# EAGLE design afron_atmega328_chassis_B (EAGLE 6.1)
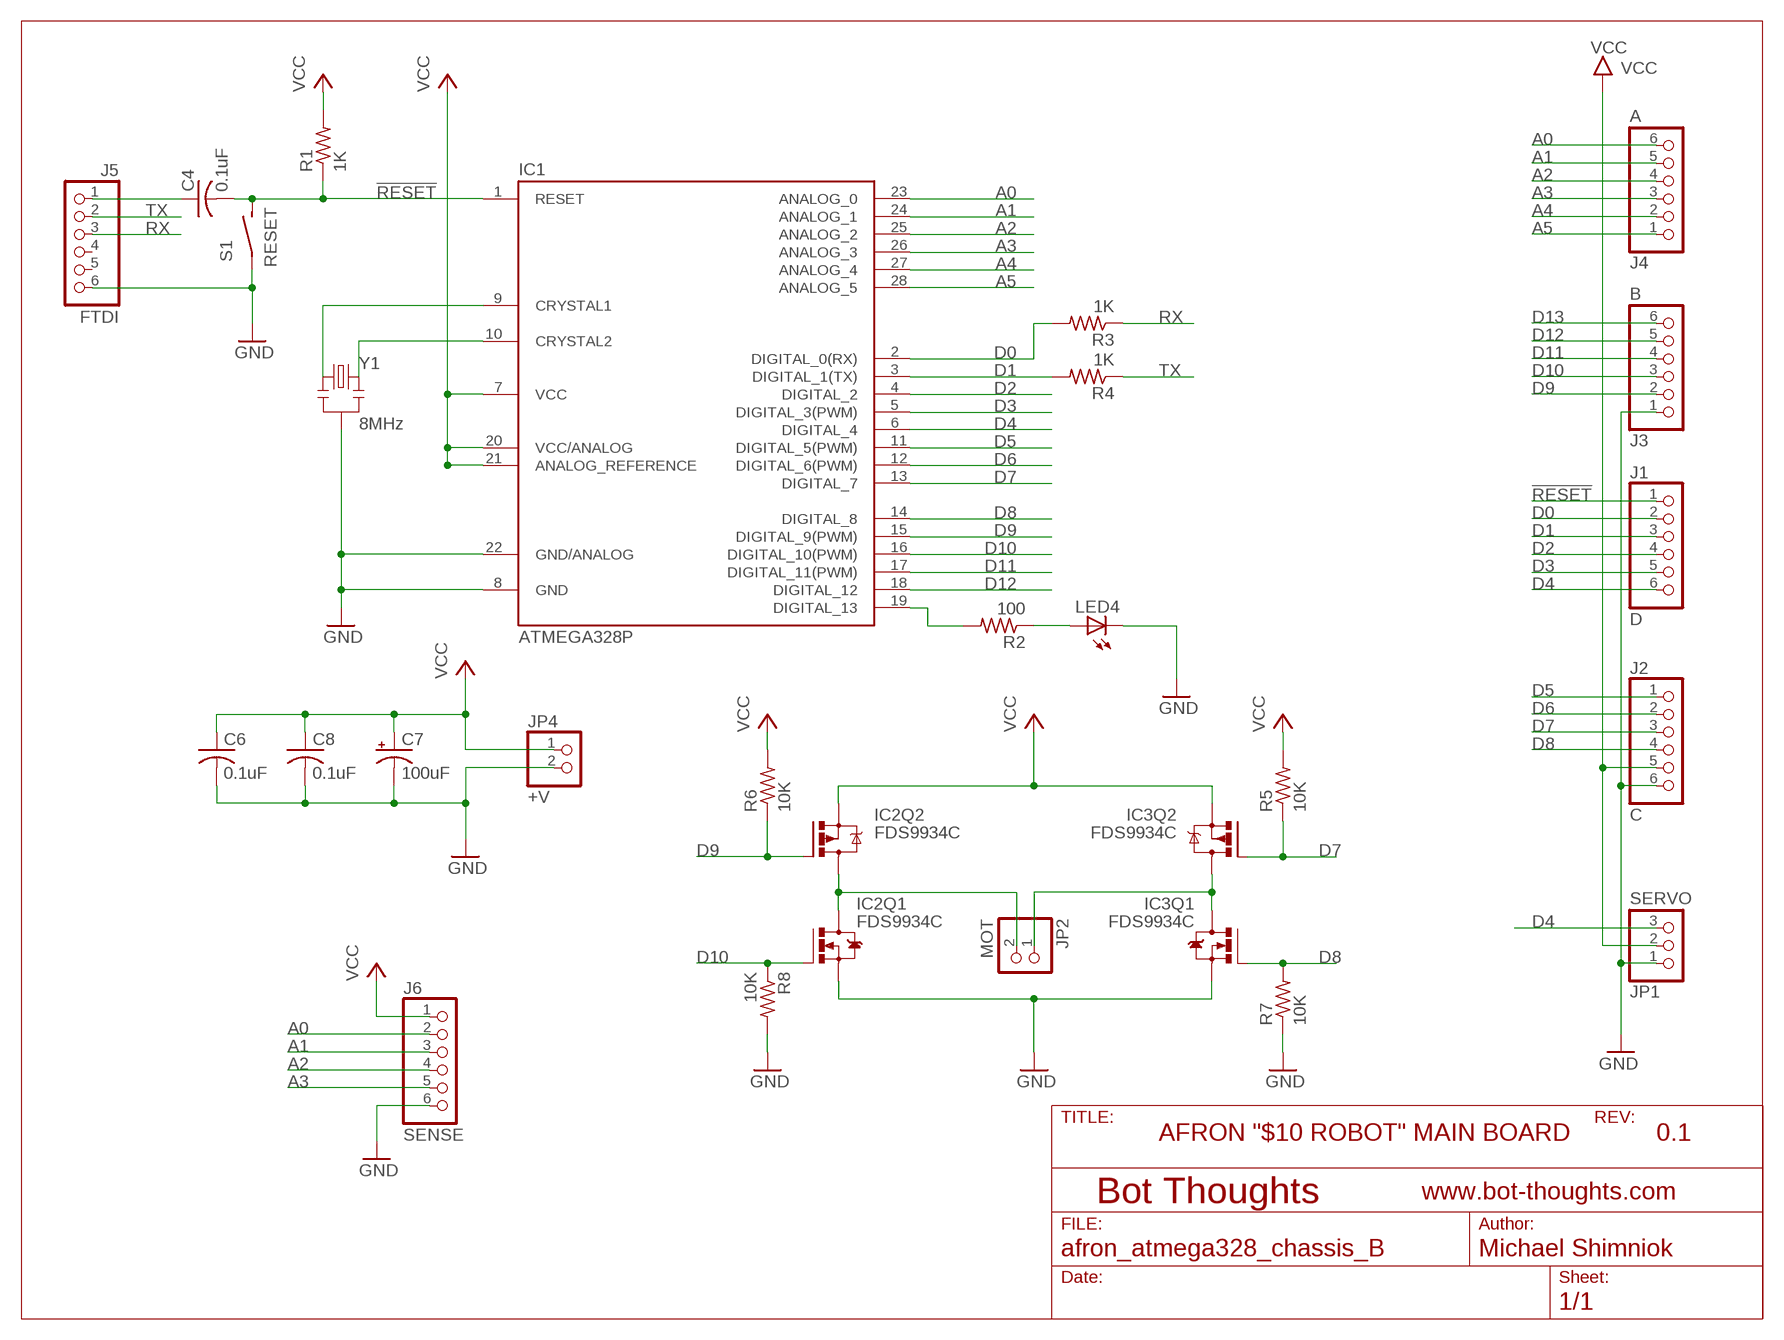
[diagram p0: schematic, sheet 1]

## Parts
C4  0.1uF  C-US050-024X044  [C050-024X044]
C6  0.1uF  C-US050-024X044  [C050-024X044]
C7  100uF  CPOL-USE2.5-6  [E2,5-6]
C8  0.1uF  C-US050-024X044  [C050-024X044]
IC1  ATMEGA328P  ATMEGA168-PU  [DIL28-3]
IC2  FDS9934C  [SOIC8]
IC3  FDS9934C  [SOIC8]
J1  D  PINHD-1X06_2.54  [1X06]
J2  C  PINHD-1X06_2.54  [1X06]
J3  B  PINHD-1X06_2.54  [1X06]
J4  A  PINHD-1X06_2.54  [1X06]
J5  FTDI  PINHD-1X06_2.54  [1X06]
J6  SENSE  PINHD-1X06_2.54  [1X06]
JP1  SERVO  PINHD-1X03_2.54  [1X03]
JP2  MOT  PINHD-1X02_2.54-S  [1X02-S]
JP4  +V  PINHD-1X02_2.54-S  [1X02-S]
LED4  LED3MM  [LED3MM]
R1  1K  R-US_0204/5  [0204/5]
R2  100  R-US_0204/5  [0204/5]
R3  1K  R-US_0204/5  [0204/5]
R4  1K  R-US_0204/5  [0204/5]
R5  10K  R-US_0204/5  [0204/5]
R6  10K  R-US_0204/5  [0204/5]
R7  10K  R-US_0204/5  [0204/5]
R8  10K  R-US_0204/5  [0204/5]
S1  RESET  SPST_TACT2  [6MMTACTILE]
Y1  8MHz  RESONATORPTH  [RESONATOR-PTH]

## Nets
!RESET: C4.2 IC1.1(RESET) J1.1 R1.1 S1.P$2(S)
A0: IC1.23(ANALOG_0) J4.6 J6.2
A1: IC1.24(ANALOG_1) J4.5 J6.3
A2: IC1.25(ANALOG_2) J4.4 J6.4
A3: IC1.26(ANALOG_3) J4.3 J6.5
A4: IC1.27(ANALOG_4) J4.2
A5: IC1.28(ANALOG_5) J4.1
D0: IC1.2(DIGITAL_0(RX)) J1.2 R3.2
D1: IC1.3(DIGITAL_1(TX)) J1.3 R4.2
D2: IC1.4(DIGITAL_2) J1.4
D3: IC1.5(DIGITAL_3(PWM)) J1.5
D4: IC1.6(DIGITAL_4) J1.6 JP1.3
D5: IC1.11(DIGITAL_5(PWM)) J2.1
D6: IC1.12(DIGITAL_6(PWM)) J2.2
D7: IC1.13(DIGITAL_7) IC3.4(Q2:G) J2.3 R5.1
D8: IC1.14(DIGITAL_8) IC3.2(Q1:G) J2.4 R7.2
D9: IC1.15(DIGITAL_9(PWM)) IC2.4(Q2:G) J3.2 R6.1
D10: IC1.16(DIGITAL_10(PWM)) IC2.2(Q1:G) J3.3 R8.1
D11: IC1.17(DIGITAL_11(PWM)) J3.4
D12: IC1.18(DIGITAL_12) J3.5
D13: IC1.19(DIGITAL_13) J3.6 R2.2
GND: C6.2 C7.- C8.2 IC1.8(GND) IC1.22(GND/ANALOG) IC2.1(Q1:S) IC3.1(Q1:S) J2.6 J3.1 J5.6 J6.6 JP1.1 JP4.2 LED4.K(C) R7.1 R8.2 S1.P$1(P) Y1.2
MA: IC2.5(Q2:D) IC2.6(Q2:D) IC2.7(Q1:D) IC2.8(Q1:D) JP2.2
MB: IC3.5(Q2:D) IC3.6(Q2:D) IC3.7(Q1:D) IC3.8(Q1:D) JP2.1
N$2: IC1.9(CRYSTAL1) Y1.1
N$3: IC1.10(CRYSTAL2) Y1.3
N$4: C4.1 J5.1
N$6: LED4.A R2.1
RX: J5.3 R3.1
TX: J5.2 R4.1
VCC: C6.1 C7.+ C8.1 IC1.7(VCC) IC1.20(VCC/ANALOG) IC1.21(ANALOG_REFERENCE) IC2.3(Q2:S) IC3.3(Q2:S) J2.5 J6.1 JP1.2 JP4.1 R1.2 R5.2 R6.2
Unconnected: J5.4 J5.5

## Notes on the sheet
- AFRON "$10 ROBOT" MAIN BOARD | 0.1

## Library data of the parts
C4 C6 C8 = rcl:C-US: CAPACITOR, American symbol
C7 = rcl:CPOL-US: POLARIZED CAPACITOR, American symbol
IC1 = Arduino-AVR:ATMEGA168-PU
IC2 IC3 = mes_motor_driver:FDS9934C: Complementary MOSFET These dual N- and P-Channel enhancement mode power field effect transistors are produced using Fairchild Semiconductor’s advanced PowerTrench process that has been especially tailored to minimize on-state ressitance and yet maintain superior switching performance. These devices are well suited for low voltage and battery powered applications where low in-line power loss and fast switching are required. http://www.fairchildsemi.com/ds/FD/FDS9934C.pdf
J1-J6 = pinhead-2:PINHD-1X06: PIN HEADER
JP1 = pinhead-2:PINHD-1X03: PIN HEADER
JP2 JP4 = pinhead-2:PINHD-1X02: PIN HEADER
LED4 = led:LED: LED OSRAM: - CHIPLED LG R971, LG N971, LY N971, LG Q971, LY Q971, LO R971, LY R971 LH N974, LH R974 LS Q976, LO Q976, LY Q976 LO Q996 - Hyper CHIPLED LW Q18S LB Q993, LB Q99A, LB R99A - SideLED LS A670, LO A670, LY A670, LG A670, LP A670 LB A673, LV A673, LT A673, LW A673 LH A674 LY A675 LS A676, LA A676, LO A676, LY A676, LW A676 LS A679, LY A679, LG A679 - Hyper Micro SIDELED® LS Y876, LA Y876, LO Y876, LY Y876 LT Y87S - SmartLED LW L88C, LW L88S LB L89C, LB L89S, LG L890 LS L89K, LO L89K, LY L89K LS L896, LA L896, LO L896, LY L896 - TOPLED LS T670, LO T670, LY T670, LG T670, LP T670 LSG T670, LSP T670, LSY T670, LOP T670, LYG T670 LG T671, LOG T671, LSG T671 LB T673, LV T673, LT T673, LW T673 LH T674 LS T676, LA T676, LO T676, LY T676, LB T676, LH T676, LSB T676, LW T676 LB T67C, LV T67C, LT T67C, LS T67K, LO T67K, LY T67K, LW E67C LS E67B, LA E67B, LO E67B, LY E67B, LB E67C, LV E67C, LT E67C LW T67C LS T679, LY T679, LG T679 LS T770, LO T770, LY T770, LG T770, LP T770 LB T773, LV T773, LT T773, LW T773 LH T774 LS E675, LA E675, LY E675, LS T675 LS T776, LA T776, LO T776, LY T776, LB T776 LHGB T686 LT T68C, LB T68C - Hyper Mini TOPLED® LB M676 - Mini TOPLED Santana® LG M470 LS M47K, LO M47K, LY M47K Source: http://www.osram.convergy.de LUXEON: - LUMILED® LXK2-PW12-R00, LXK2-PW12-S00, LXK2-PW14-U00, LXK2-PW14-V00 LXK2-PM12-R00, LXK2-PM12-S00, LXK2-PM14-U00 LXK2-PE12-Q00, LXK2-PE12-R00, LXK2-PE12-S00, LXK2-PE14-T00, LXK2-PE14-U00 LXK2-PB12-K00, LXK2-PB12-L00, LXK2-PB12-M00, LXK2-PB14-N00, LXK2-PB14-P00, LXK2-PB14-Q00 LXK2-PR12-L00, LXK2-PR12-M00, LXK2-PR14-Q00, LXK2-PR14-R00 LXK2-PD12-Q00, LXK2-PD12-R00, LXK2-PD12-S00 LXK2-PH12-R00, LXK2-PH12-S00 LXK2-PL12-P00, LXK2-PL12-Q00, LXK2-PL12-R00 Source: www.luxeon.com KINGBRIGHT: KA-3528ASYC Source: www.kingbright.com
R1-R8 = resistor:R-US_: RESISTOR, American symbol
S1 = mes_electromech:SPST: SPST SWITCH
Y1 = SparkFun:RESONATOR: Resonator Small SMD resonator. This is the itty bitty 10/20MHz resonators with built in caps. CSTCE10M0G55 and CSTCE20M0V53. Footprint has been reviewed closely but hasn't been tested yet.

## Board
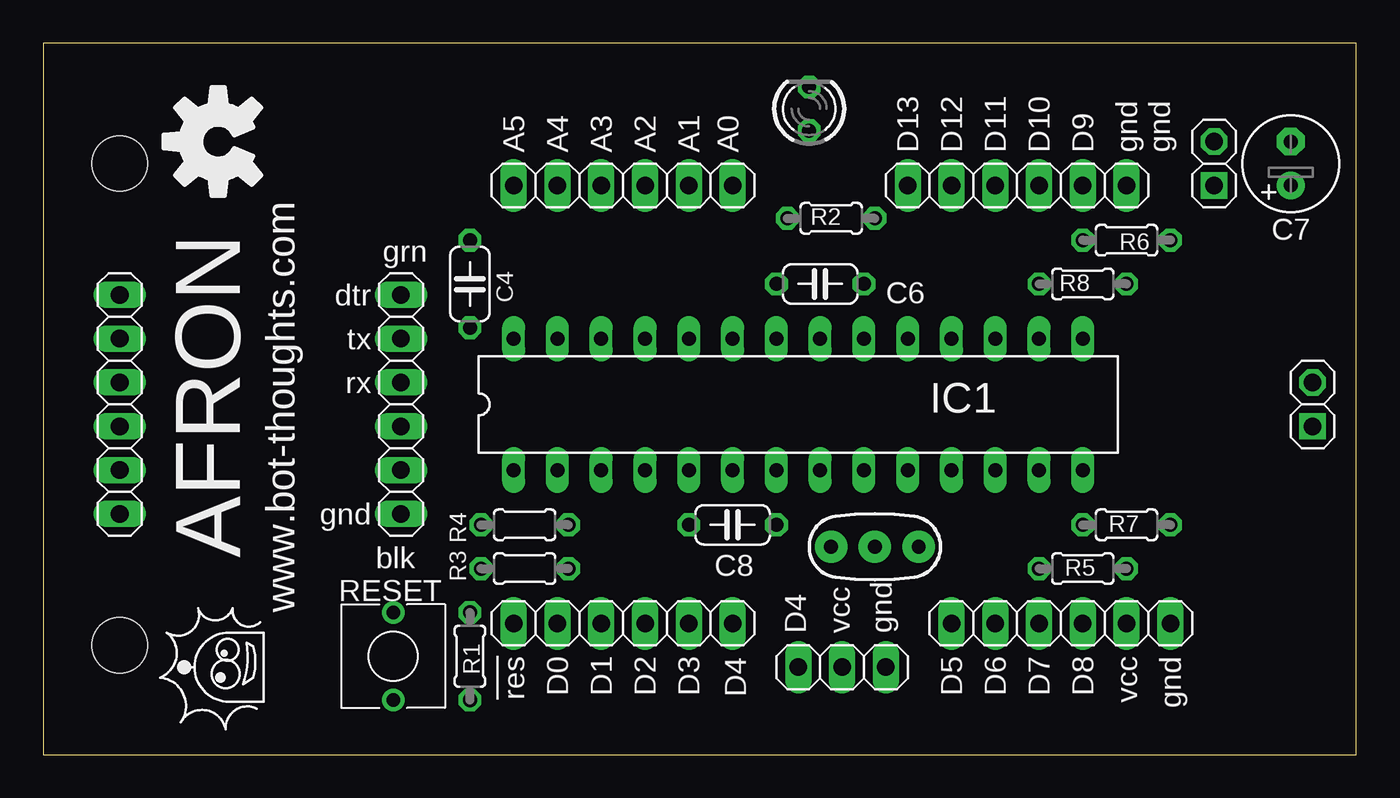
[diagram p1: board, top side]
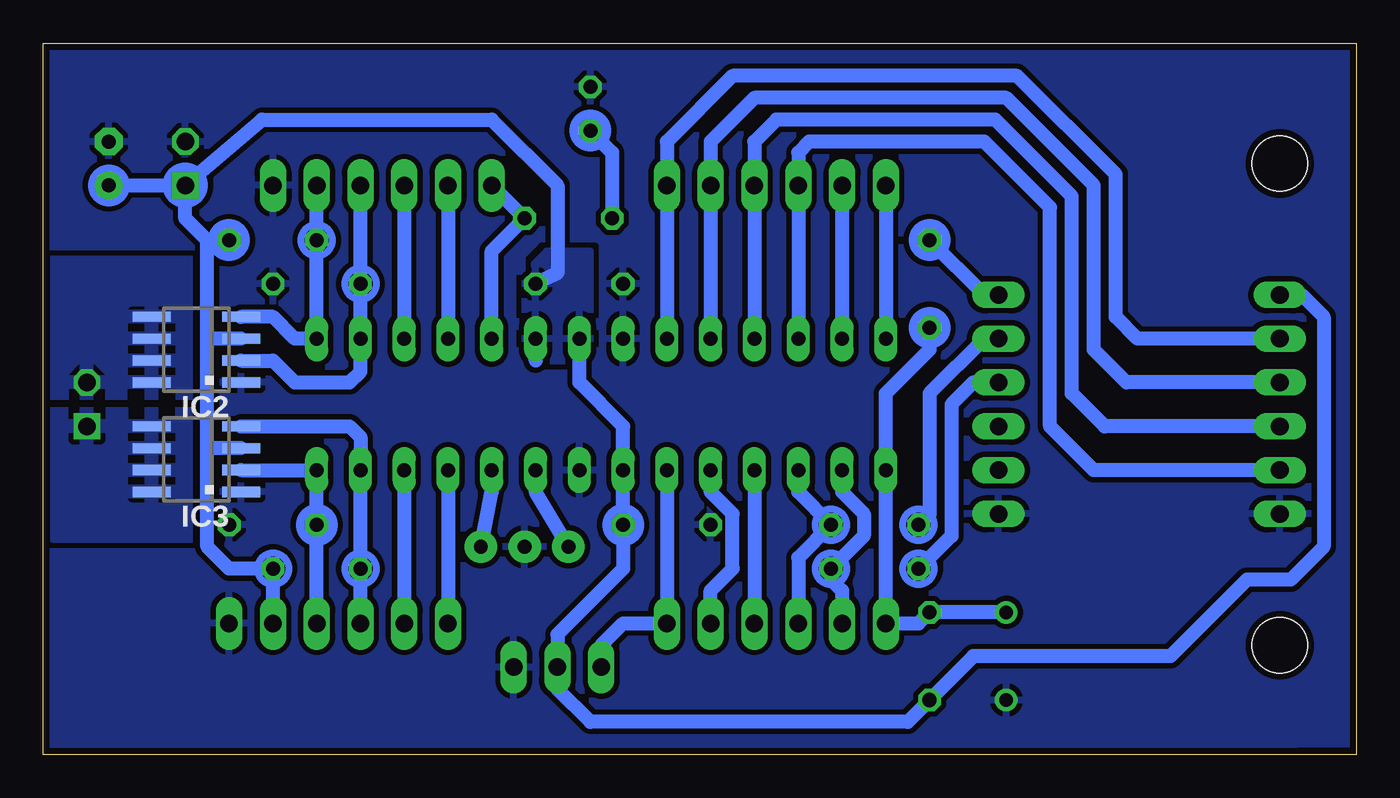
[diagram p2: board, bottom side, seen from below]

Size 76.2 x 41.27 mm. Coordinates in mm from the lower left corner, seen from the top.
Outline: 76.2,0 76.2,41.27 0,41.27 0,0 76.2,0
Copper layers (1*16): Top 0.0356mm / dielectric 1.5011mm / Bottom 0.0356mm
Design rules: minimum track width 6mil, minimum drill 13mil, track to track 6mil, track to pad 6mil, pad to pad 6mil, via to via 6mil, smd to smd 6mil, copper to edge 15mil, drill to drill 6mil, minimum pad ring 10mil, minimum via ring 7mil, stop-mask expansion 4mil, vias tented up to drill 0mil, thermal gap 12mil
Holes 3.2 mm at 4.45,6.35 4.45,34.29

### Footprints (pad centres in the part's own frame; a part is rotated, then mirrored left to right if it is on the bottom)
C050-024X044 = drill 0.813 octagon: 1 -2.54,0; 2 2.54,0
E2,5-6 = drill 0.813 pad 1.6: + -1.27,0 | drill 0.813 pad 1.6 octagon: - 1.27,0
DIL28-3 = drill 0.813 long: 1 -16.51,-3.81; 2 -13.97,-3.81; 3 -11.43,-3.81; 4 -8.89,-3.81; 5 -6.35,-3.81; 6 -3.81,-3.81; 7 -1.27,-3.81; 8 1.27,-3.81; 9 3.81,-3.81; 10 6.35,-3.81; 11 8.89,-3.81; 12 11.43,-3.81; 13 13.97,-3.81; 14 16.51,-3.81; 15 16.51,3.81; 16 13.97,3.81; 17 11.43,3.81; 18 8.89,3.81; 19 6.35,3.81; 20 3.81,3.81; 21 1.27,3.81; 22 -1.27,3.81; 23 -3.81,3.81; 24 -6.35,3.81; 25 -8.89,3.81; 26 -11.43,3.81; 27 -13.97,3.81; 28 -16.51,3.81
SOIC8 = smd 0.6 x 2.2: 1 -1.905,-2.6; 2 -0.635,-2.6; 3 0.635,-2.6; 4 1.905,-2.6; 5 1.905,2.6; 6 0.635,2.6; 7 -0.635,2.6; 8 -1.905,2.6
1X06 = drill 1.016 long: 1 -6.35,0; 2 -3.81,0; 3 -1.27,0; 4 1.27,0; 5 3.81,0; 6 6.35,0
1X03 = drill 1.016 long: 1 -2.54,0; 2 0,0; 3 2.54,0
1X02-S = drill 1.016 square: 1 -1.27,0 | drill 1.016 octagon: 2 1.27,0
LED3MM = drill 0.813 octagon: A -1.27,0; K 1.27,0
0204/5 = drill 0.813 octagon: 1 -2.54,0; 2 2.54,0
6MMTACTILE = drill 0.8: P$1 -2.54,0; P$2 2.54,0
RESONATOR-PTH = drill 0.8 pad 1.88: 1 -2.54,0; 2 0,0; 3 2.54,0

### Placement (x,y rotation side)
C4  24.77,27.3 270 top
C6  45.09,27.3 180 top
C7  72.39,34.29 90 top
C8  40.01,13.34 180 top
IC1  43.81,20.32 0 top
IC2  67.31,23.5 90 bottom
IC3  67.31,17.14 90 bottom
J1  33.66,7.62 0 top
J2  59.05,7.62 0 top
J3  56.52,33.02 180 top
J4  33.66,33.02 0 top
J5  20.77,20.32 270 top
J6  4.45,20.32 270 top
JP1  46.35,5.08 180 top
JP2  73.66,20.32 90 top
JP4  67.94,34.29 90 top
LED4  44.45,37.47 90 top
R1  24.77,5.71 270 top
R2  45.72,31.11 0 top
R3  27.94,10.79 0 top
R4  27.94,13.34 0 top
R5  60.33,10.79 0 top
R6  62.87,29.84 0 top
R7  62.87,13.34 180 top
R8  60.33,27.3 0 top
S1  20.32,5.71 90 top
Y1  48.26,12.06 0 top

### Tracks (layer width: path | path; a pad name or v marks a point on that pad's centre or on a via)
!RESET
  Bottom 0.813: S1.P$2 R1.1 25.4,7.62 J1.1 IC1.1 27.3,20.95 24.77,23.5 C4.2
A0
  Bottom 0.813: IC1.23 J4.6 40.01,35.56 36.2,39.37 19.68,39.37 13.97,33.66 13.97,25.4 12.7,24.13 J6.2
A1
  Bottom 0.813: IC1.24 J4.5 37.47,35.56 34.92,38.1 20.32,38.1 15.24,33.02 15.24,23.5 13.34,21.59 J6.3
A2
  Bottom 0.813: IC1.25 J4.4 34.92,35.56 33.66,36.83 20.95,36.83 16.51,32.38 16.51,20.95 14.61,19.05 J6.4
A3
  Bottom 0.813: IC1.26 J4.3 32.38,34.92 31.75,35.56 21.59,35.56 17.78,31.75 17.78,19.05 15.24,16.51 J6.5
A4
  Bottom 0.813: J4.2 IC1.27
A5
  Bottom 0.813: J4.1 IC1.28
D0
  Bottom 0.813: IC1.2 29.84,15.24 28.57,13.97 28.57,12.7 R3.2 30.48,10.16 29.84,9.53 J1.2
D1
  Bottom 0.813: IC1.3 32.38,15.24 R4.2 32.38,11.43 J1.3
D2
  Bottom 0.813: IC1.4 J1.4
D3
  Bottom 0.813: J1.5 37.47,9.53 36.2,10.79 36.2,13.97 37.47,15.24 IC1.5
D4
  Bottom 0.813: IC1.6 J1.6 42.55,7.62 43.81,6.35 JP1.3
D5
  Bottom 0.813: IC1.11 J2.1
D6
  Bottom 0.813: IC1.12 J2.2
D7
  Bottom 0.813: IC3.4 58.42,19.05 57.78,18.41 IC1.13 R5.1 J2.3
D8
  Bottom 0.813: IC3.2 IC1.14 R7.2 J2.4
D9
  Bottom 0.813: IC2.4 62.87,25.4 61.59,24.13 IC1.15 R6.1 J3.2
D10
  Bottom 0.813: IC2.2 62.87,22.86 61.59,21.59 58.42,21.59 57.78,22.23 IC1.16 R8.1 J3.3
D11
  Bottom 0.813: J3.4 IC1.17
D12
  Bottom 0.813: J3.5 IC1.18
D13
  Bottom 0.813: IC1.19 50.16,29.21 R2.2 J3.6
GND
  pour Bottom (isolate 0.305, rank 4): 0,0.64 0,41.59 76.2,40.96 76.2,0
MA
  pour Bottom (isolate 0.406): 67.31,20.95 76.2,20.95 76.2,28.57 67.31,28.57
MB
  pour Bottom (isolate 0.406, rank 2): 67.31,20.32 75.56,20.32 75.56,12.7 67.31,12.7
N$2
  Bottom 0.813: Y1.1 47.62,15.24 IC1.9
N$3
  Bottom 0.813: Y1.3 50.16,15.24 IC1.10
N$4
  Bottom 0.813: J5.1 21.59,26.67 C4.1
N$6
  Bottom 0.813: LED4.A 43.18,34.92 R2.1
RX
  Bottom 0.813: J5.3 22.23,21.59 23.5,20.32 23.5,12.7 R3.1
TX
  Bottom 0.813: J5.2 21.59,24.13 24.77,20.95 24.77,13.97 R4.1
VCC
  Bottom 0.813: IC1.21 45.09,21.59 42.55,19.05 IC1.7 C8.1 42.55,10.79 46.35,6.99 JP1.2 46.35,3.81 44.45,1.91 26.04,1.91 R1.2 22.23,5.71 10.79,5.71 6.35,10.16 3.81,10.16 1.91,12.06 1.91,25.4 3.17,26.67 J6.1 | 47.62,22.86 IC1.20 | JP4.1 63.5,36.83 50.16,36.83 46.35,33.02 46.35,27.94 C6.1 | C7.+ JP4.1 | R6.2 66.67,29.84 | 66.67,29.84 67.94,31.11 JP4.1 | IC2.3 66.67,24.13 | 66.67,24.13 66.67,29.84 | IC3.3 66.67,17.78 | 66.67,17.78 66.67,24.13 | J2.5 R5.2 65.41,10.79 66.67,12.06 66.67,17.78
  pour Bottom: 44.45,29.21 46.99,29.21 48.26,27.94 48.26,22.86 44.45,22.86
(copper drawn outside any net)
  shapes: Bottom circle x17

### Text on the board
tPlace: AFRON | www.bot-thoughts.com
tNames: A5 | A4 | A3 | A2 | A1 | A0 | D13 | D12 | D11 | D10 | D9 | gnd | gnd | grn | dtr | tx | rx | gnd | blk | RESET | D4 | vcc | gnd | !res | D0 | D1 | D2 | D3 | D4 | D5 | D6 | D7 | D8 | vcc | gnd